# EAGLE design snes-usb-wire (EAGLE 6.1)
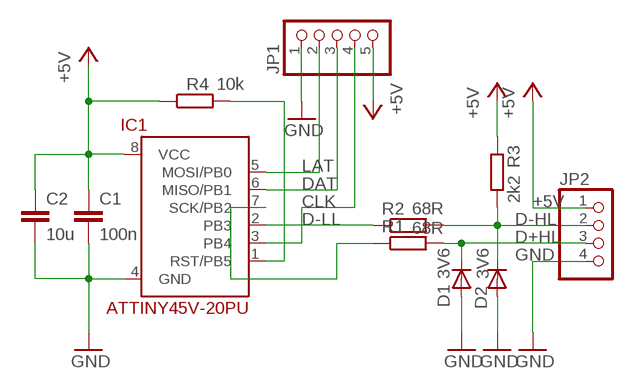
[diagram p0: schematic, sheet 1]

## Parts
C1  100n  C-EUC0805K  [C0805K]
C2  10u  C-EUC0805K  [C0805K]
D1  3V6  DIODE-D-2.5  [D-2.5]
D2  3V6  DIODE-D-2.5  [D-2.5]
IC1  ATTINY45V-20PU  ATTINY13V-10PU  [DIL08]
JP1  PINHD-1X5  [1X05]
JP2  PINHD-1X4  [1X04]
R1  68R  R-EU_M0805  [M0805]
R2  68R  R-EU_M0805  [M0805]
R3  2k2  R-EU_M0805  [M0805]
R4  10k  R-EU_M0805  [M0805]

## Nets
+5V: C1.1 C2.1 IC1.8(VCC) JP1.5 JP2.1 R3.1 R4.1
CLK: IC1.3(PB4) JP1.4
D+HL: D1.C JP2.3 R1.2
D-HL: D2.C JP2.2 R2.2 R3.2
D-LL: IC1.2(PB3) R2.1
DAT: IC1.6(MISO/PB1) JP1.3
GND: C1.2 C2.2 D1.A D2.A IC1.4(GND) JP1.1 JP2.4
LAT: IC1.5(MOSI/PB0) JP1.2
N$1: IC1.1(RST/PB5) R4.2
N$2: IC1.7(SCK/PB2) R1.1

## Library data of the parts
C1 C2 = rcl:C-EU: CAPACITOR, European symbol
D1 D2 = diode:DIODE-: DIODE
IC1 = attiny13:ATTINY13V-10*
JP1 = pinhead:PINHD-1X5: PIN HEADER
JP2 = pinhead:PINHD-1X4: PIN HEADER
R1-R4 = rcl:R-EU_: RESISTOR, European symbol

## Board
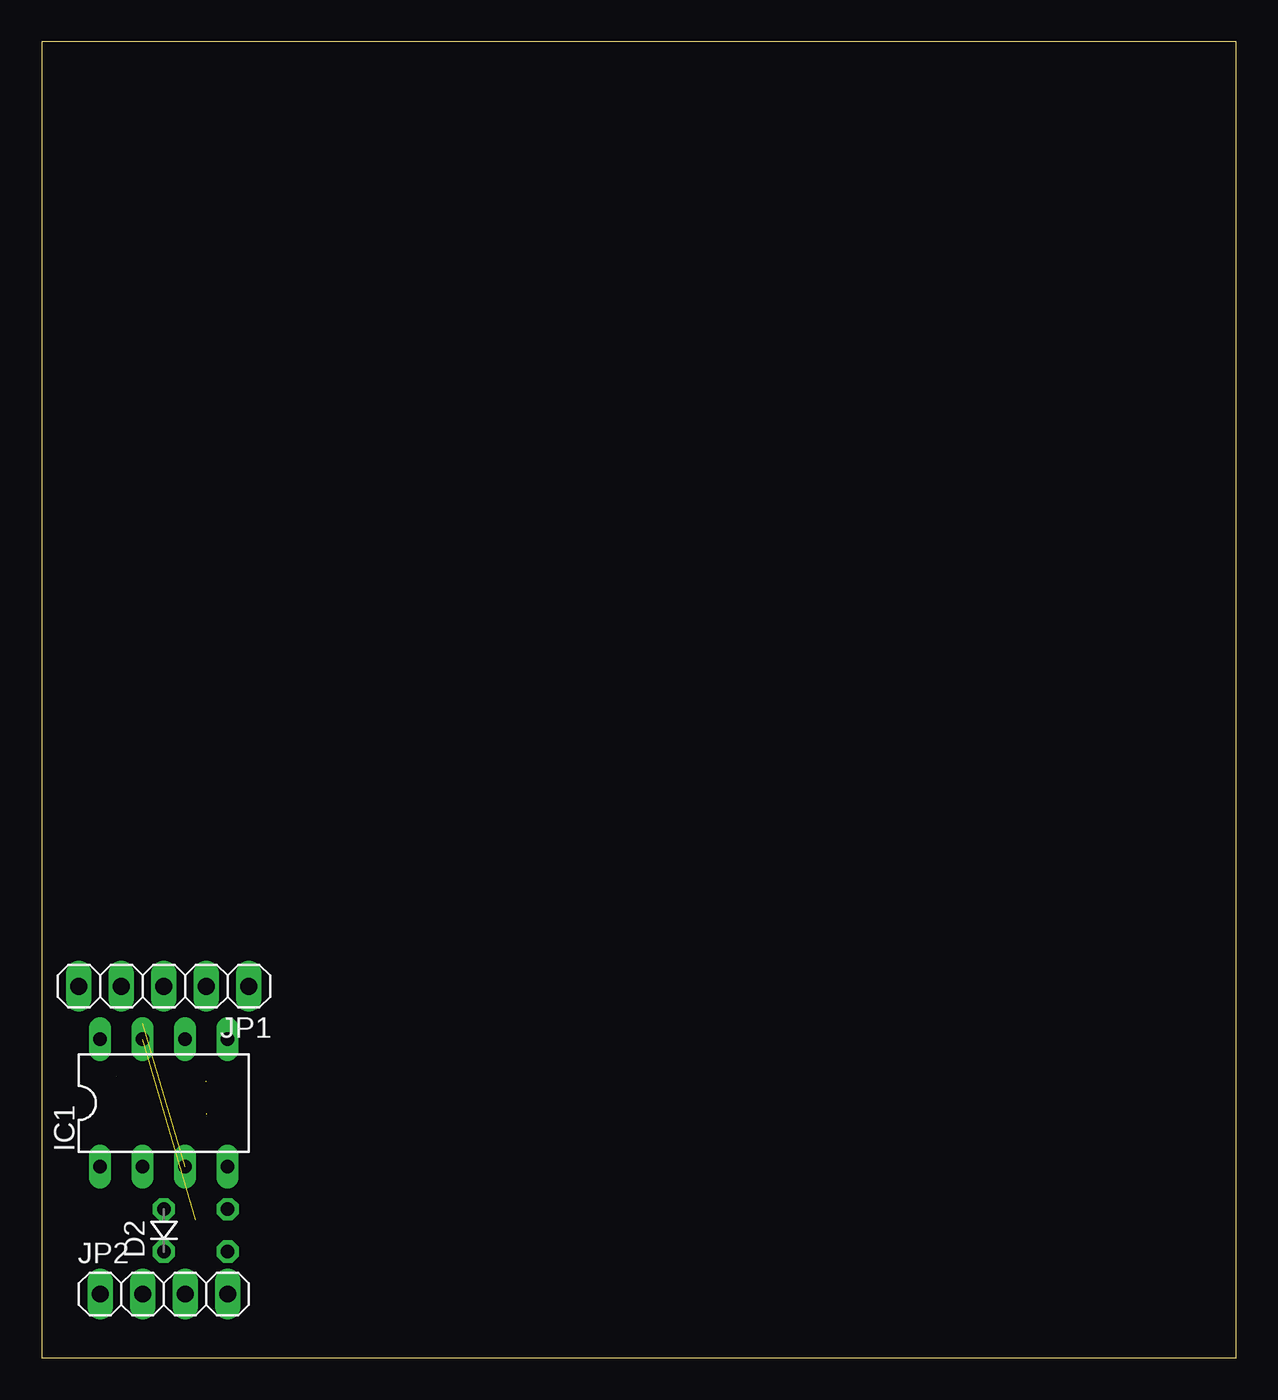
[diagram p1: board, top side]
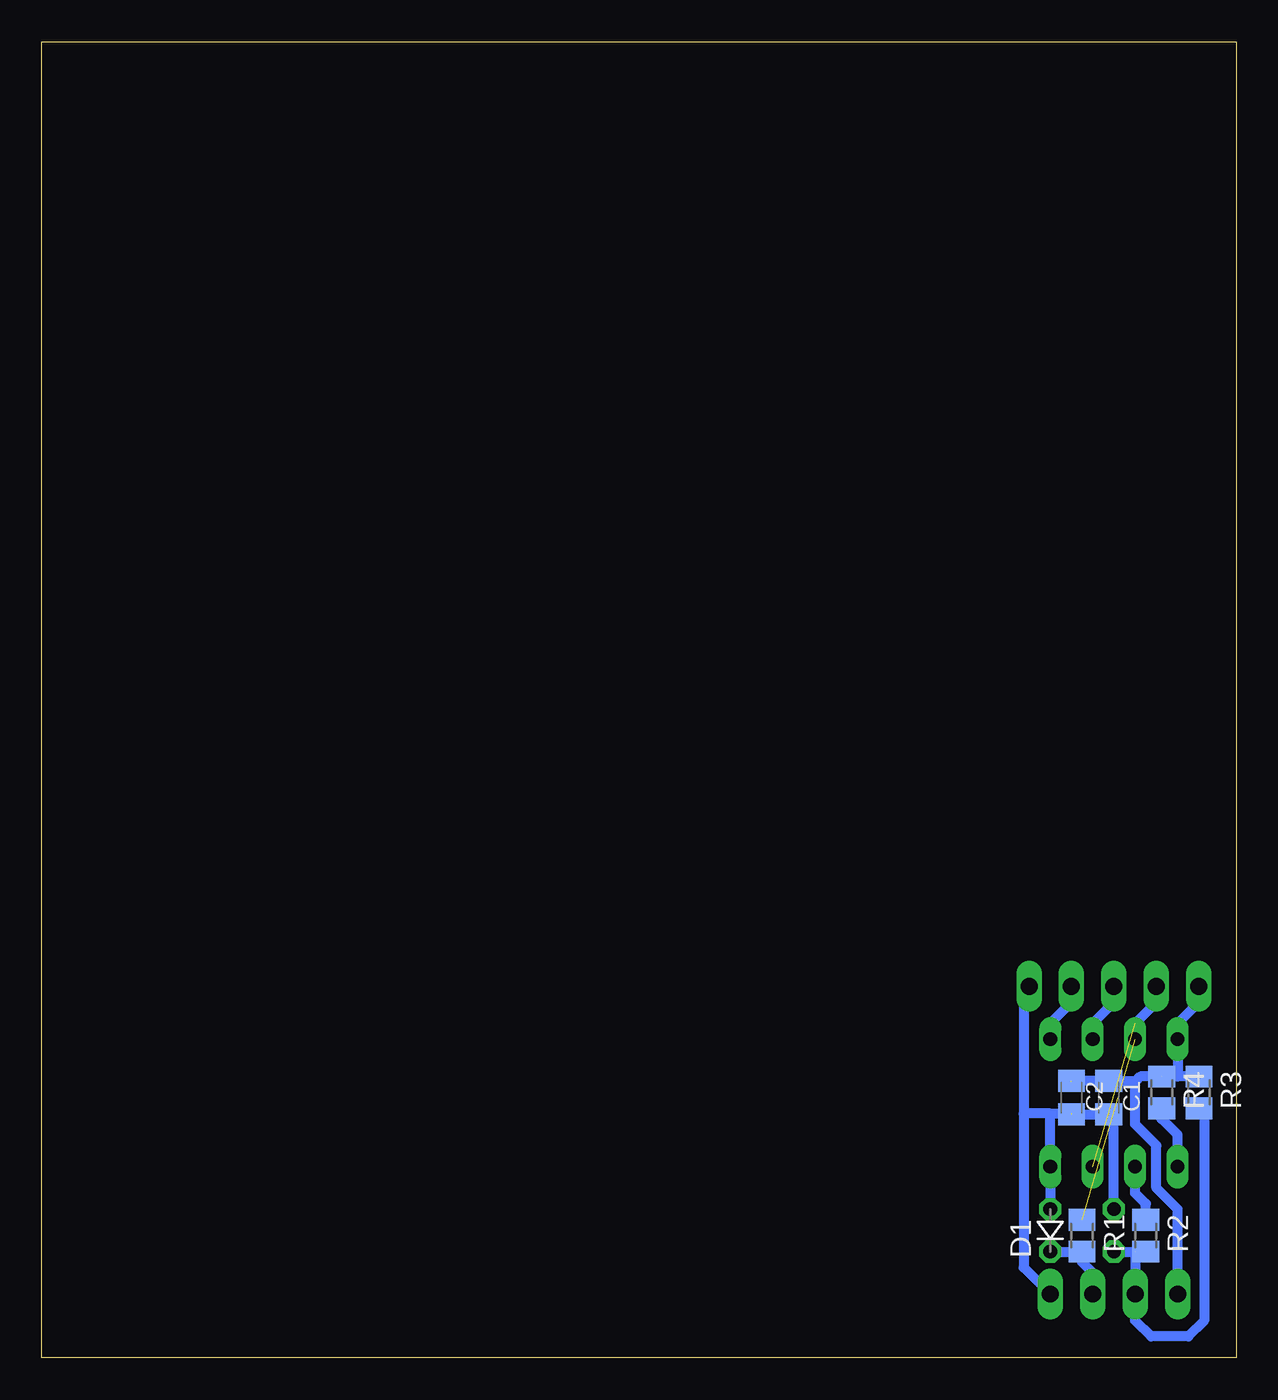
[diagram p2: board, bottom side, seen from below]

Size 71.42 x 78.73 mm. Coordinates in mm from the lower left corner, seen from the top.
Outline: 0,0 71.42,0 71.42,78.73 0,78.73 0,0
Copper layers (1*16): Top 0.035mm / dielectric 1.5mm / Bottom 0.035mm
Design rules: minimum track width 10mil, minimum drill 24mil, track to track 8mil, track to pad 8mil, pad to pad 8mil, via to via 8mil, smd to smd 8mil, copper to edge 40mil, drill to drill 8mil, minimum pad ring 10mil, minimum via ring 8mil, stop-mask expansion 4mil, vias tented up to drill 0mil, thermal gap 10mil

### Footprints (pad centres in the part's own frame; a part is rotated, then mirrored left to right if it is on the bottom)
C0805K = smd 1.3 x 1.6: 1 -1,0; 2 1,0
D-2.5 = drill 0.813 octagon: A 1.27,0; C -1.27,0
DIL08 = drill 0.813 long: 1 -3.81,-3.81; 2 -1.27,-3.81; 3 1.27,-3.81; 4 3.81,-3.81; 5 3.81,3.81; 6 1.27,3.81; 7 -1.27,3.81; 8 -3.81,3.81
1X05 = drill 1.016 long: 1 -5.08,0; 2 -2.54,0; 3 0,0; 4 2.54,0; 5 5.08,0
1X04 = drill 1.016 long: 1 -3.81,0; 2 -1.27,0; 3 1.27,0; 4 3.81,0
M0805 = smd 1.3 x 1.6: 1 -0.95,0; 2 0.95,0

### Placement (x,y rotation side)
C1  7.62,15.56 270 bottom
C2  9.84,15.56 270 bottom
D1  11.11,7.62 90 bottom
D2  7.3,7.62 90 top
IC1  7.3,15.24 0 top
JP1  7.3,22.23 180 top
JP2  7.3,3.81 0 top
R1  9.21,7.3 270 bottom
R2  5.4,7.3 270 bottom
R3  2.22,15.88 270 bottom
R4  4.45,15.88 270 bottom

### Tracks (layer width: path | path; a pad name or v marks a point on that pad's centre or on a via)
+5V  (2 unrouted)
  Bottom 0.61: JP2.1 3.49,8.89 4.76,10.16 4.76,12.7 6.03,13.97 6.03,16.51 | R3.1 3.49,16.82 | 3.49,16.82 5.08,16.82 5.08,16.83 | 3.49,16.82 IC1.8 3.49,20 2.22,21.27 JP1.5 | 5.08,16.83 R4.1 | 6.03,16.51 6.08,16.56 C1.1 9.16,16.56 9.21,16.51 9.84,16.51 | 5.08,16.83 5.71,16.83 6.03,16.51
CLK  (1 unrouted)
  Bottom 0.61: JP1.4 4.76,21.27 6.03,20
D+HL
  Bottom 0.61: JP2.3 8.57,5.08 9.21,5.71 R1.2 9.53,6.35 D1.C
D-HL  (1 unrouted)
  Bottom 0.61: D2.C 6.04,6.35 R2.2 | 5.4,6.67 6.03,6.35 JP2.2 6.03,2.22 5.08,1.27 2.86,1.27 1.91,2.22 1.91,14.61 R3.2
D-LL
  Bottom 0.61: R2.1 5.4,9.21 6.03,9.84 IC1.2
DAT
  Bottom 0.61: JP1.3 7.3,21.27 8.57,20 IC1.6
GND  (2 unrouted)
  Bottom 0.61: 11.11,14.61 IC1.4 D1.A | 12.7,14.61 12.7,5.4 JP2.4 | 11.11,14.61 12.7,14.61 | D2.A 7.3,14.61 7.62,14.61 | JP1.1 12.38,21.59 12.7,21.27 12.7,14.61 | C2.2 C1.2 | 11.11,14.61 9.84,14.61
LAT
  Bottom 0.61: JP1.2 9.84,21.27 11.11,20 IC1.5
N$1
  Bottom 0.61: IC1.1 3.49,13.34 4.45,14.29 R4.2
N$2  (1 unrouted)